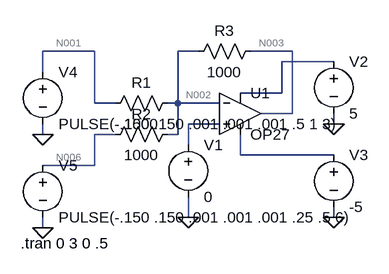
[diagram p0: schematic Draft4.asc]
Draft4.asc, the LTspice schematic file:
Version 4
SHEET 1 880 680
WIRE 64 32 -16 32
WIRE 224 32 192 32
WIRE 368 32 304 32
WIRE 432 48 352 48
WIRE -16 64 -16 32
WIRE 352 96 352 48
WIRE 352 96 288 96
WIRE 64 112 64 32
WIRE 96 112 64 112
WIRE 192 112 192 32
WIRE 192 112 176 112
WIRE 256 112 192 112
WIRE 368 128 368 32
WIRE 368 128 320 128
WIRE 256 144 208 144
WIRE 432 144 432 128
WIRE -16 160 -16 144
WIRE 96 160 64 160
WIRE 192 160 192 112
WIRE 192 160 176 160
WIRE 208 176 208 144
WIRE 288 192 288 160
WIRE 432 192 288 192
WIRE 64 208 64 160
WIRE 64 208 -16 208
WIRE 208 288 208 256
WIRE 432 288 432 272
WIRE -16 304 -16 288
FLAG 208 288 0
FLAG 432 144 0
FLAG 432 288 0
FLAG -16 160 0
FLAG -16 304 0
SYMBOL Opamps\\OP27 288 64 R0
SYMATTR InstName U1
SYMBOL res 192 96 R90
WINDOW 0 0 56 VBottom 2
WINDOW 3 32 56 VTop 2
SYMATTR InstName R1
SYMATTR Value 1000
SYMBOL res 192 144 R90
WINDOW 0 0 56 VBottom 2
WINDOW 3 32 56 VTop 2
SYMATTR InstName R2
SYMATTR Value 1000
SYMBOL res 320 16 R90
WINDOW 0 0 56 VBottom 2
WINDOW 3 32 56 VTop 2
SYMATTR InstName R3
SYMATTR Value 1000
SYMBOL voltage 208 160 R0
WINDOW 123 0 0 Left 2
WINDOW 39 0 0 Left 2
SYMATTR InstName V1
SYMATTR Value 0
SYMBOL voltage 432 32 R0
WINDOW 123 0 0 Left 2
WINDOW 39 0 0 Left 2
SYMATTR InstName V2
SYMATTR Value 5
SYMBOL voltage 432 176 R0
WINDOW 123 0 0 Left 2
WINDOW 39 0 0 Left 2
SYMATTR InstName V3
SYMATTR Value -5
SYMBOL voltage -16 48 R0
WINDOW 123 0 0 Left 2
WINDOW 39 0 0 Left 2
SYMATTR InstName V4
SYMATTR Value PULSE(-.150 .150 .001 .001 .001 .5 1 3)
SYMBOL voltage -16 192 R0
WINDOW 123 0 0 Left 2
WINDOW 39 0 0 Left 2
SYMATTR InstName V5
SYMATTR Value PULSE(-.150 .150 .001 .001 .001 .25 .5 6)
TEXT -50 328 Left 2 !.tran 0 3 0 .5

The netlist it stands for:
* Draft4.asc
XU1 N005 N002 N004 N007 N003 OP27  ; pins In+ In- V+ V- OUT
R1 N002 N001 1000
R2 N002 N006 1000
R3 N003 N002 1000
V1 N005 0 0
V2 N004 0 5
V3 N007 0 -5
V4 N001 0 PULSE(-.150 .150 .001 .001 .001 .5 1 3)
V5 N006 0 PULSE(-.150 .150 .001 .001 .001 .25 .5 6)
.tran 0 3 0 .5
.lib ADI.lib
.backanno
.end

* Results of the author's LTspice run, read from the files saved beside the schematic
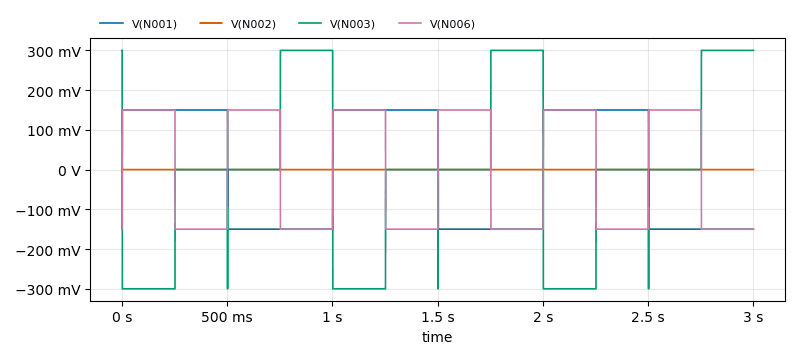
[diagram p1: Transient Analysis of Draft4.asc, plotted from the saved traces]
* Transient Analysis, 1 run:
*   V(N001): min -150 mV, max 150 mV, average 300 µV, rms 150 mV, last -150 mV
*   V(N002): min -4.407 µV, max 8.832 µV, average 165.3 nV, rms 3.01 µV, last -14.46 nV
*   V(N003): min -300 mV, max 300 mV, average -899.5 µV, rms 212.3 mV, last 300 mV
*   V(N006): min -150 mV, max 150 mV, average 600 µV, rms 150 mV, last -150 mV